# Altium schematic sheet Zigbee_Module.SchDoc: Zigbee Module
size A4
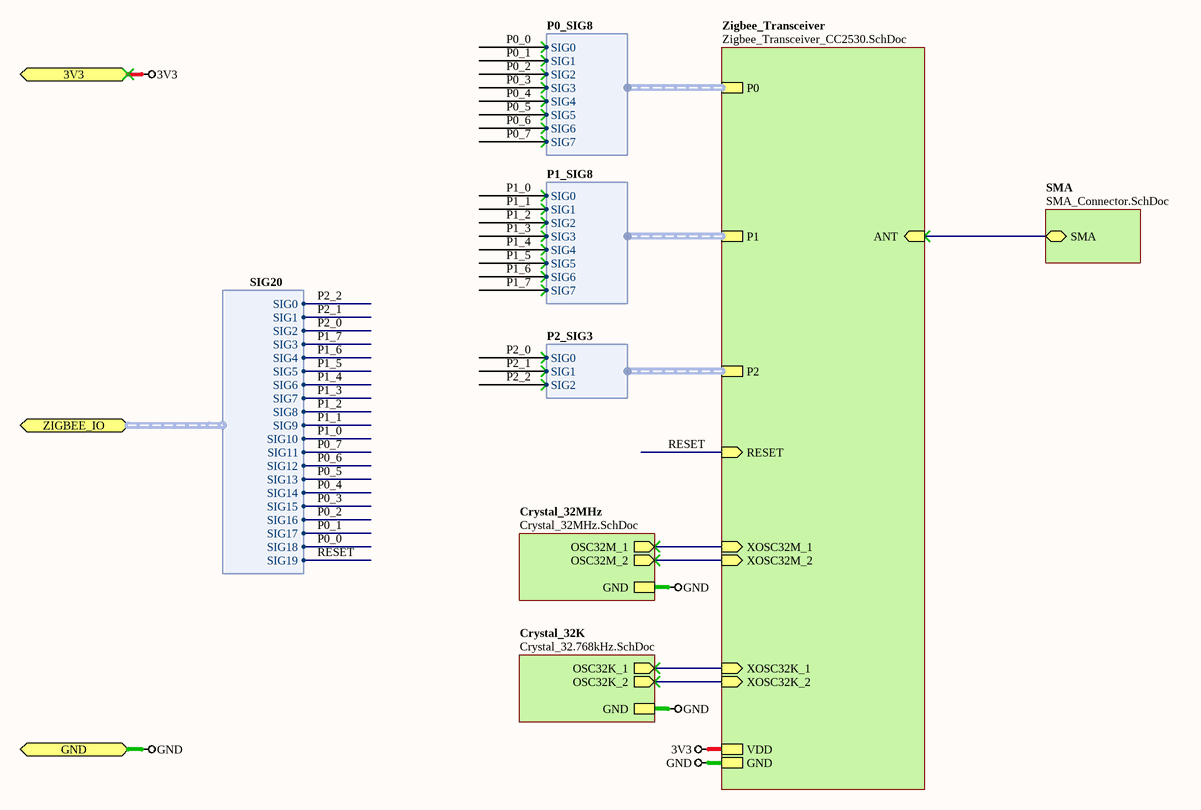
[diagram p0: Zigbee_Module.SchDoc]

## Sub-sheets
Crystal_32K = Crystal_32.768kHz.SchDoc: GND, OSC32K_1 (out), OSC32K_2 (out)
Crystal_32MHz = Crystal_32MHz.SchDoc: OSC32M_1 (out), GND, OSC32M_2 (out)
SMA = SMA_Connector.SchDoc: SMA (bidir)
Zigbee_Transceiver = Zigbee_Transceiver_CC2530.SchDoc: XOSC32M_1 (in), XOSC32M_2 (in), ANT (in), XOSC32K_1 (in), XOSC32K_2 (in), VDD, GND, RESET (in), P0 (harness P0_SIG8), P1 (harness P1_SIG8), P2 (harness P2_SIG3)

## Ports
3V3, GND, ZIGBEE_IO (harness SIG20)

## Harnesses
SIG20: SIG0, SIG1, SIG2, SIG3, SIG4, SIG5, SIG6, SIG7, SIG8, SIG9, SIG10, SIG11, SIG12, SIG13, SIG14, SIG15, SIG16, SIG17, SIG18, SIG19
P0_SIG8: SIG0, SIG1, SIG2, SIG3, SIG4, SIG5, SIG6, SIG7
P1_SIG8: SIG0, SIG1, SIG2, SIG3, SIG4, SIG5, SIG6, SIG7
P2_SIG3: SIG0, SIG1, SIG2

## Nets
3V3: port 3V3, sheet Zigbee_Transceiver/VDD
GND: port GND, sheet Crystal_32K/GND, sheet Crystal_32MHz/GND, sheet Zigbee_Transceiver/GND
P0_0: port ZIGBEE_IO.SIG18, sheet Zigbee_Transceiver/P0.SIG0
P0_1: port ZIGBEE_IO.SIG17, sheet Zigbee_Transceiver/P0.SIG1
P0_2: port ZIGBEE_IO.SIG16, sheet Zigbee_Transceiver/P0.SIG2
P0_3: port ZIGBEE_IO.SIG15, sheet Zigbee_Transceiver/P0.SIG3
P0_4: port ZIGBEE_IO.SIG14, sheet Zigbee_Transceiver/P0.SIG4
P0_5: port ZIGBEE_IO.SIG13, sheet Zigbee_Transceiver/P0.SIG5
P0_6: port ZIGBEE_IO.SIG12, sheet Zigbee_Transceiver/P0.SIG6
P0_7: port ZIGBEE_IO.SIG11, sheet Zigbee_Transceiver/P0.SIG7
P1_0: port ZIGBEE_IO.SIG10, sheet Zigbee_Transceiver/P1.SIG0
P1_1: port ZIGBEE_IO.SIG9, sheet Zigbee_Transceiver/P1.SIG1
P1_2: port ZIGBEE_IO.SIG8, sheet Zigbee_Transceiver/P1.SIG2
P1_3: port ZIGBEE_IO.SIG7, sheet Zigbee_Transceiver/P1.SIG3
P1_4: port ZIGBEE_IO.SIG6, sheet Zigbee_Transceiver/P1.SIG4
P1_5: port ZIGBEE_IO.SIG5, sheet Zigbee_Transceiver/P1.SIG5
P1_6: port ZIGBEE_IO.SIG4, sheet Zigbee_Transceiver/P1.SIG6
P1_7: port ZIGBEE_IO.SIG3, sheet Zigbee_Transceiver/P1.SIG7
P2_0: port ZIGBEE_IO.SIG2, sheet Zigbee_Transceiver/P2.SIG0
P2_1: port ZIGBEE_IO.SIG1, sheet Zigbee_Transceiver/P2.SIG1
P2_2: port ZIGBEE_IO.SIG0, sheet Zigbee_Transceiver/P2.SIG2
RESET: sheet Zigbee_Transceiver/RESET, port ZIGBEE_IO.SIG19
(unnamed): sheet SMA/SMA, sheet Zigbee_Transceiver/ANT
(unnamed): sheet Crystal_32K/OSC32K_1, sheet Zigbee_Transceiver/XOSC32K_1
(unnamed): sheet Crystal_32K/OSC32K_2, sheet Zigbee_Transceiver/XOSC32K_2
(unnamed): sheet Crystal_32MHz/OSC32M_1, sheet Zigbee_Transceiver/XOSC32M_1
(unnamed): sheet Crystal_32MHz/OSC32M_2, sheet Zigbee_Transceiver/XOSC32M_2

## Notes on the sheet
- Sheet Title
- Project Title
- Size:
- Date:
- A4
- Item:
- Time:
- Revision:
- Sheet
- of
- File: